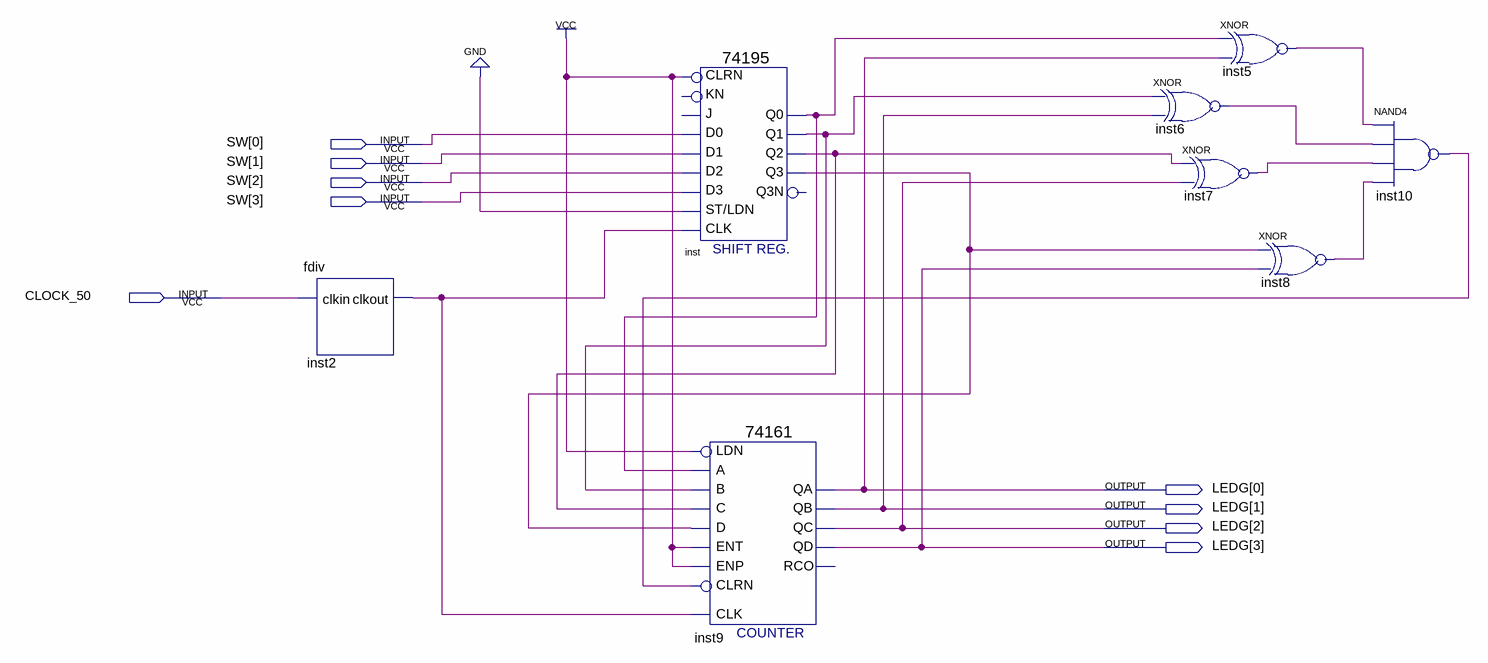
[diagram p0: schematic sheet]
// Quartus schematic Lab12.bdf as structural Verilog: 8 symbols, 9 pins
module Lab12 (
  input  [3:0] SW,
  input  CLOCK_50,
  output [3:0] LEDG
);

  wire inst2_clkout, inst5_out, inst6_out, inst7_out, inst8_out, inst10_out, inst_q0, inst_q1, inst_q2,
       inst_q3;

  fdiv inst2 (.clkin(CLOCK_50), .clkout(inst2_clkout));
  \74195  inst (
    .\ST/LDN (1'b0), .CLRN(1'b1), .D2(SW[2]), .D1(SW[1]), .D0(SW[0]), .CLK(inst2_clkout), .D3(SW[3]),
    .Q3(inst_q3), .Q0(inst_q0), .Q1(inst_q1), .Q2(inst_q2));  // open: KN, J, Q3N
  \74161  inst9 (
    .CLRN(inst10_out), .CLK(inst2_clkout), .ENP(1'b1), .LDN(1'b1), .A(inst_q0), .D(inst_q3), .ENT(1'b1),
    .B(inst_q1), .C(inst_q2), .QD(LEDG[3]), .QC(LEDG[2]), .QB(LEDG[1]), .QA(LEDG[0]));  // open: RCO
  xnor inst6 (inst6_out, inst_q1, LEDG[1]);
  xnor inst5 (inst5_out, inst_q0, LEDG[0]);
  xnor inst7 (inst7_out, inst_q2, LEDG[2]);
  xnor inst8 (inst8_out, inst_q3, LEDG[3]);
  nand inst10 (inst10_out, inst5_out, inst6_out, inst7_out, inst8_out);
endmodule
